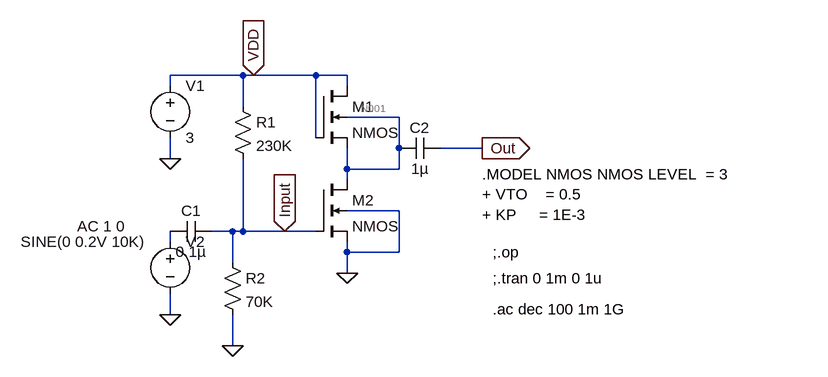
[diagram p0: schematic ass_2_ques_3.asc]
ass_2_ques_3.asc, the LTspice schematic file:
Version 4
SHEET 1 880 680
WIRE -48 48 -160 48
WIRE -32 48 -48 48
WIRE 64 48 -32 48
WIRE 112 48 64 48
WIRE -160 64 -160 48
WIRE 112 64 112 48
WIRE -48 96 -48 48
WIRE 192 112 112 112
WIRE 64 144 64 48
WIRE 192 160 192 112
WIRE 320 160 256 160
WIRE -160 176 -160 144
WIRE 112 192 112 160
WIRE 192 192 192 160
WIRE 192 192 112 192
WIRE 112 208 112 192
WIRE 192 256 112 256
WIRE -64 288 -96 288
WIRE -48 288 -48 176
WIRE -48 288 -64 288
WIRE 16 288 -48 288
WIRE 64 288 16 288
WIRE -160 304 -160 288
WIRE 112 320 112 304
WIRE 192 320 192 256
WIRE 192 320 112 320
WIRE -64 336 -64 288
WIRE 112 352 112 320
WIRE -160 416 -160 384
WIRE -64 464 -64 416
FLAG 112 352 0
FLAG -160 176 0
FLAG -160 416 0
FLAG 16 288 Input
IOPIN 16 288 In
FLAG -32 48 VDD
IOPIN -32 48 In
FLAG 320 160 Out
IOPIN 320 160 Out
FLAG -64 464 0
SYMBOL nmos4 64 64 R0
SYMATTR InstName M1
SYMATTR Value2 l=500n w=1u
SYMBOL nmos4 64 208 R0
SYMATTR InstName M2
SYMATTR Value2 l=500n w=25u
SYMBOL voltage -160 48 R0
WINDOW 123 0 0 Left 0
WINDOW 39 0 0 Left 0
SYMATTR InstName V1
SYMATTR Value 3
SYMBOL voltage -160 288 R0
WINDOW 3 -230 16 Left 2
WINDOW 123 -143 -8 Left 2
WINDOW 39 0 0 Left 0
SYMATTR Value SINE(0 0.2V 10K)
SYMATTR Value2 AC 1 0
SYMATTR InstName V2
SYMBOL cap -96 272 R90
WINDOW 0 0 32 VBottom 2
WINDOW 3 32 32 VTop 2
SYMATTR InstName C1
SYMATTR Value 0.1µ
SYMBOL cap 256 144 R90
WINDOW 0 0 32 VBottom 2
WINDOW 3 32 32 VTop 2
SYMATTR InstName C2
SYMATTR Value 1µ
SYMBOL res -64 80 R0
SYMATTR InstName R1
SYMATTR Value 230K
SYMBOL res -80 320 R0
SYMATTR InstName R2
SYMATTR Value 70K
TEXT 320 200 Left 2 !.MODEL NMOS NMOS LEVEL  = 3                  \n+ VTO    = 0.5      \n+ KP     = 1E-3
TEXT 336 320 Left 2 !;.op
TEXT 336 360 Left 2 !;.tran 0 1m 0 1u
TEXT 336 408 Left 2 !.ac dec 100 1m 1G

The netlist it stands for:
* ass_2_ques_3.asc
M1 VDD VDD N001 N001 NMOS l=500n w=1u
M2 N001 Input 0 0 NMOS l=500n w=25u
V1 VDD 0 3
V2 N002 0 SINE(0 0.2V 10K) AC 1 0
C1 Input N002 0.1µ
C2 Out N001 1µ
R1 VDD Input 230K
R2 Input 0 70K
.model NMOS NMOS
.model PMOS PMOS
.lib standard.mos
.MODEL NMOS NMOS LEVEL  = 3
+ VTO    = 0.5
+ KP     = 1E-3
;.op
;.tran 0 1m 0 1u
.ac dec 100 1m 1G
.backanno
.end

* Results of the author's LTspice run, read from the files saved beside the schematic
* Operating Point, zero values left out:
*   V(vdd) = 3 V
*   V(n001) = 1.5 V
*   V(input) = 700 mV
*   V(out) = 1.5 µV
*   Id(M2) = 1 mA
*   Ib(M2) = -1.51 pA
*   Is(M2) = -1 mA
*   Id(M1) = 1 mA
*   Ib(M1) = -1.51 pA
*   Is(M1) = -1 mA
*   I(R2) = 10 µA
*   I(R1) = 10 µA
*   I(V1) = -1.01 mA
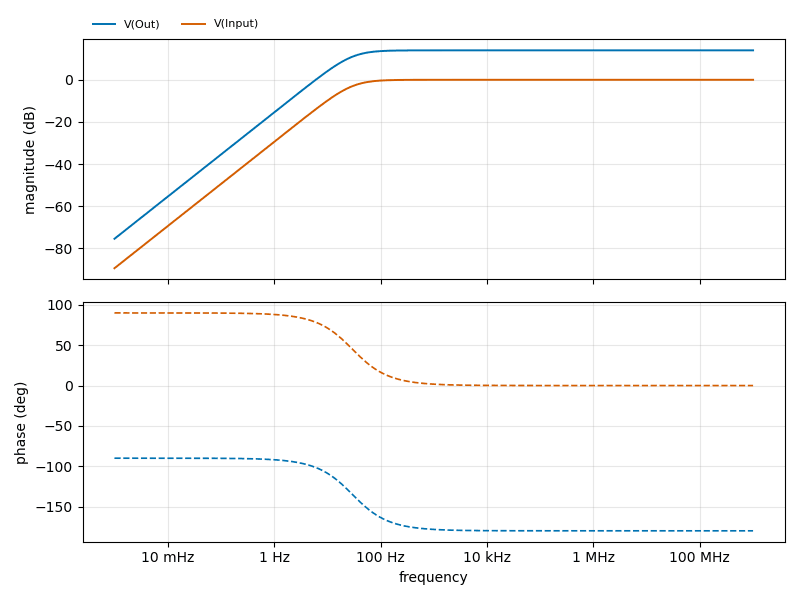
[diagram p1: AC Analysis of ass_2_ques_3.asc, plotted from the saved traces]
* AC Analysis, 1 run:
*   V(Out): -75.46 dB at 1 mHz, 13.98 dB at 1 GHz, peak 13.98 dB at 8.913 MHz, 3 dB below the peak at 29.66 Hz
*   V(Input): -89.44 dB at 1 mHz, -0.00 dB at 1 GHz, peak -0.00 dB at 891.3 MHz, 3 dB below the peak at 29.66 Hz